# Altium schematic sheet TFillChecker.schDoc
size A4
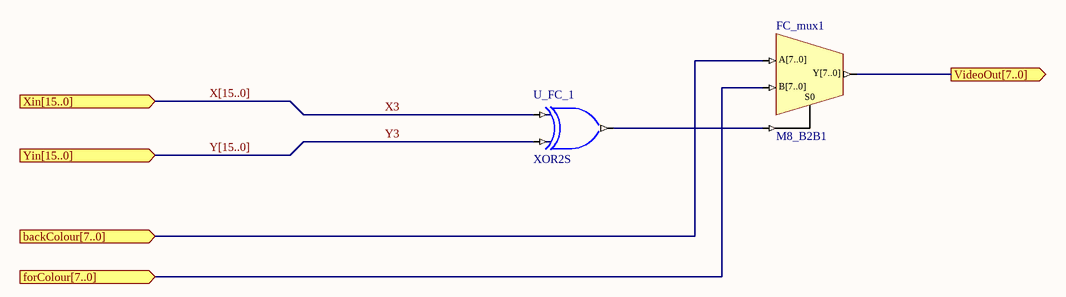
[diagram p0: TFillChecker.schDoc]

## Parts
FC_mux1  M8_B2B1
U_FC_1  XOR2S

## Ports
backColour[7..0] (in), forColour[7..0] (in), VideoOut[7..0] (out), Xin[15..0] (in), Yin[15..0] (in)

## Nets
backColour[7..0]: FC_mux1.A[7..0] ; port backColour[7..0]
forColour[7..0]: FC_mux1.B[7..0] ; port forColour[7..0]
VideoOut[7..0]: FC_mux1.Y[7..0] ; port VideoOut[7..0]
X3: U_FC_1.I0
Y3: U_FC_1.I1
NetFC_mux1_S0: FC_mux1.S0 U_FC_1.O

## Buses and harness runs
bus X[15..0] = port Xin[15..0]
bus Y[15..0] = port Yin[15..0]

## Library data of the parts
FC_mux1 = M8_B2B1: 2x8-Bit Bus to 1x8-Bit Bus Multiplexer; ArchiveName: GENERIC; Published: 9-30-2003; Publisher: Altium Limited; Core Revision: 1.00.00
U_FC_1 = XOR2S: 2-Input Exclusive-OR Gate, Single Pin Version; Xilinx Equivalent: XOR2; ArchiveName: GENERIC; Published: 9-30-2003; Publisher: Altium Limited; Core Revision: 1.00.00